# Altium schematic sheet DC Motor Control_2.SchDoc
size A4; SheetNumber: 8; SheetTotal: 8
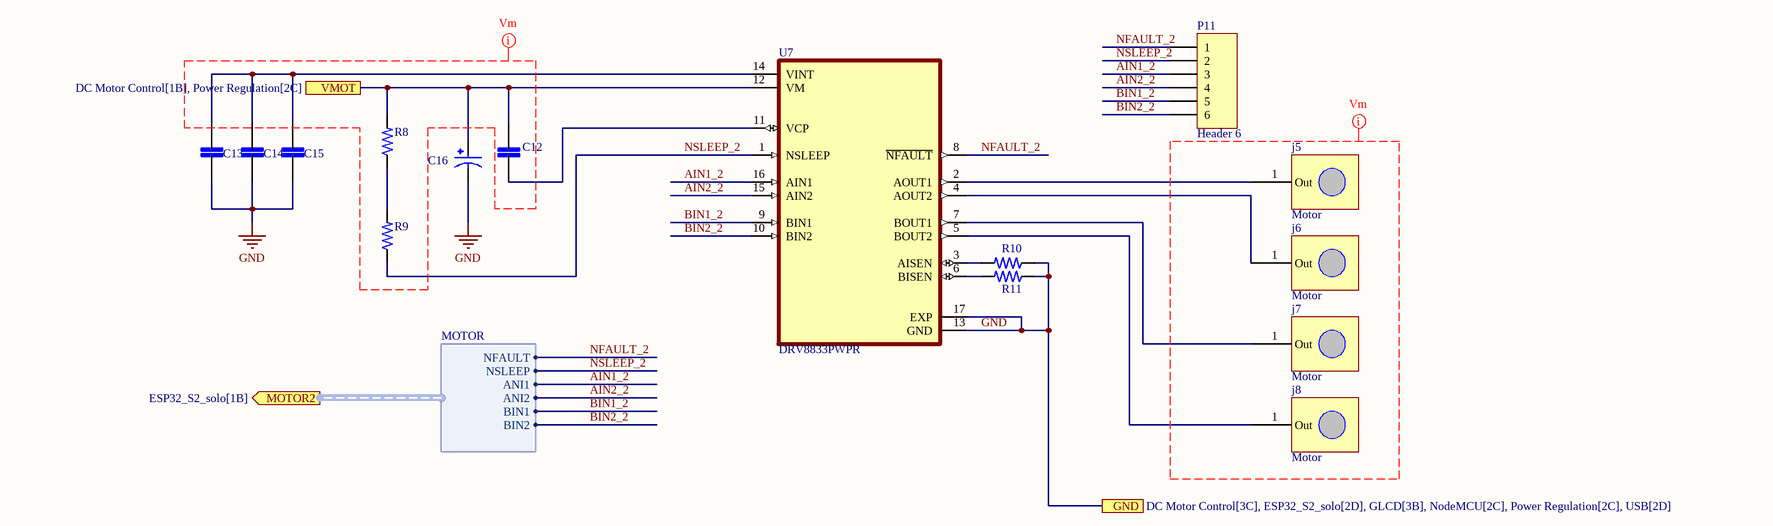
[diagram p0: DC Motor Control_2.SchDoc]

## Parts
C12  LD051A121KAB2A  [CAPC2012X140N]  (value not drawn)
C13  LD051A121KAB2A  [CAPC2012X140N]  (value not drawn)
C14  LD051A121KAB2A  [CAPC2012X140N]  (value not drawn)
C15  LD051A121KAB2A  [CAPC2012X140N]  (value not drawn)
C16  EEEHA1V101UP  [CAP_EEEHA1V101UP]  (value not drawn)
j5  Motor  [Motor_pin]
j6  Motor  [Motor_pin]
j7  Motor  [Motor_pin]
j8  Motor  [Motor_pin]
P11  Header 6  [HDR1X6]
R8  1-1879462-4  [RESC3115X65N]  (value not drawn)
R9  1-1879462-4  [RESC3115X65N]  (value not drawn)
R10  1-1879462-4  [RESC3115X65N]  (value not drawn)
R11  1-1879462-4  [RESC3115X65N]  (value not drawn)
U7  DRV8833PWPR  [IC_DRV8833PWPR]

## Ports
GND (see DC Motor Control[3C], ESP32_S2_solo[2D], GLCD[3B], NodeMCU[2C], Power Regulation[2C], USB[2D]), MOTOR2 (out, harness MOTOR, see ESP32_S2_solo[1B]), VMOT (see DC Motor Control[1B], Power Regulation[2C])

## Harnesses
MOTOR: NFAULT, NSLEEP, ANI1, ANI2, BIN1, BIN2

## Nets
GND: C13.2 C14.2 C15.2 C16.2 R10.1 R11.1 U7.13(GND) U7.17(EXP) ; port GND
AIN1_2: P11.3 U7.16(AIN1) ; port MOTOR2.ANI1
AIN2_2: P11.4 U7.15(AIN2) ; port MOTOR2.ANI2
BIN1_2: P11.5 U7.9(BIN1) ; port MOTOR2.BIN1
BIN2_2: P11.6 U7.10(BIN2) ; port MOTOR2.BIN2
NFAULT_2: P11.1 U7.8(~{NFAULT}) ; port MOTOR2.NFAULT
NSLEEP_2: P11.2 R9.1 U7.1(NSLEEP) ; port MOTOR2.NSLEEP
VMOT: C12.1 C16.1 R8.2 U7.12(VM) ; port VMOT
NetC12_2: C12.2 U7.11(VCP)
NetC13_1: C13.1 C14.1 C15.1 U7.14(VINT)
Netj5_1: j5.1(Out) U7.2(AOUT1)
Netj6_1: j6.1(Out) U7.4(AOUT2)
Netj7_1: j7.1(Out) U7.7(BOUT1)
Netj8_1: j8.1(Out) U7.5(BOUT2)
NetR8_1: R8.1 R9.2
NetR10_2: R10.2 U7.3(AISEN)
NetR11_2: R11.2 U7.6(BISEN)

## Layout directives
net class Vm; rule Width Constraint [Pref Width = 0.5mm    Min Width = 0.354mm    Max Width = 1mm]: (no net found under the mark)

## Library data of the parts
C12-C15 = LD051A121KAB2A: 120PF 100V 10% 0805; MF: {'manufacturer': u'AVX'}; Package: None; Price: None; Value: *; MP: LD051A121KAB2A; Availability: Unavailable
C16 = EEEHA1V101UP: MF: {'manufacturer': u'Panasonic'}; Value: *; MP: EEEHA1V101UP; Availability: Unavailable; Package: None; Price: None
P11 = Header 6: Header, 6-Pin; LatestRevisionDate: 17-Jul-2002; LatestRevisionNote: Re-released for DXP Platform.; Publisher: Altium Limited
R8-R11 = 1-1879462-4: RL73H 2B R43 1% 5K RL; MF: {'manufacturer': u'TE Connectivity'}; Package: None; Price: None; Value: *; MP: 1-1879462-4; Availability: Unavailable
U7 = DRV8833PWPR: 10.8-V, 2-A dual H-bridge motor driver with current regulation 16-HTSSOP -40 to 85; MF: {'manufacturer': u'Texas Instruments'}; Package: None; Price: None; MP: DRV8833PWPR; Availability: Unavailable; Value: *